# Altium schematic sheet Vapeix_mini_power.SchDoc: Vapeix Mini PCB - Power Supply
size A3; Organization: Altium Limited; Address1: L3, 12a Rodborough Rd; Address2: Frenchs Forest; Address3: NSW; Address4: Australia 2086; Revision: v2.0
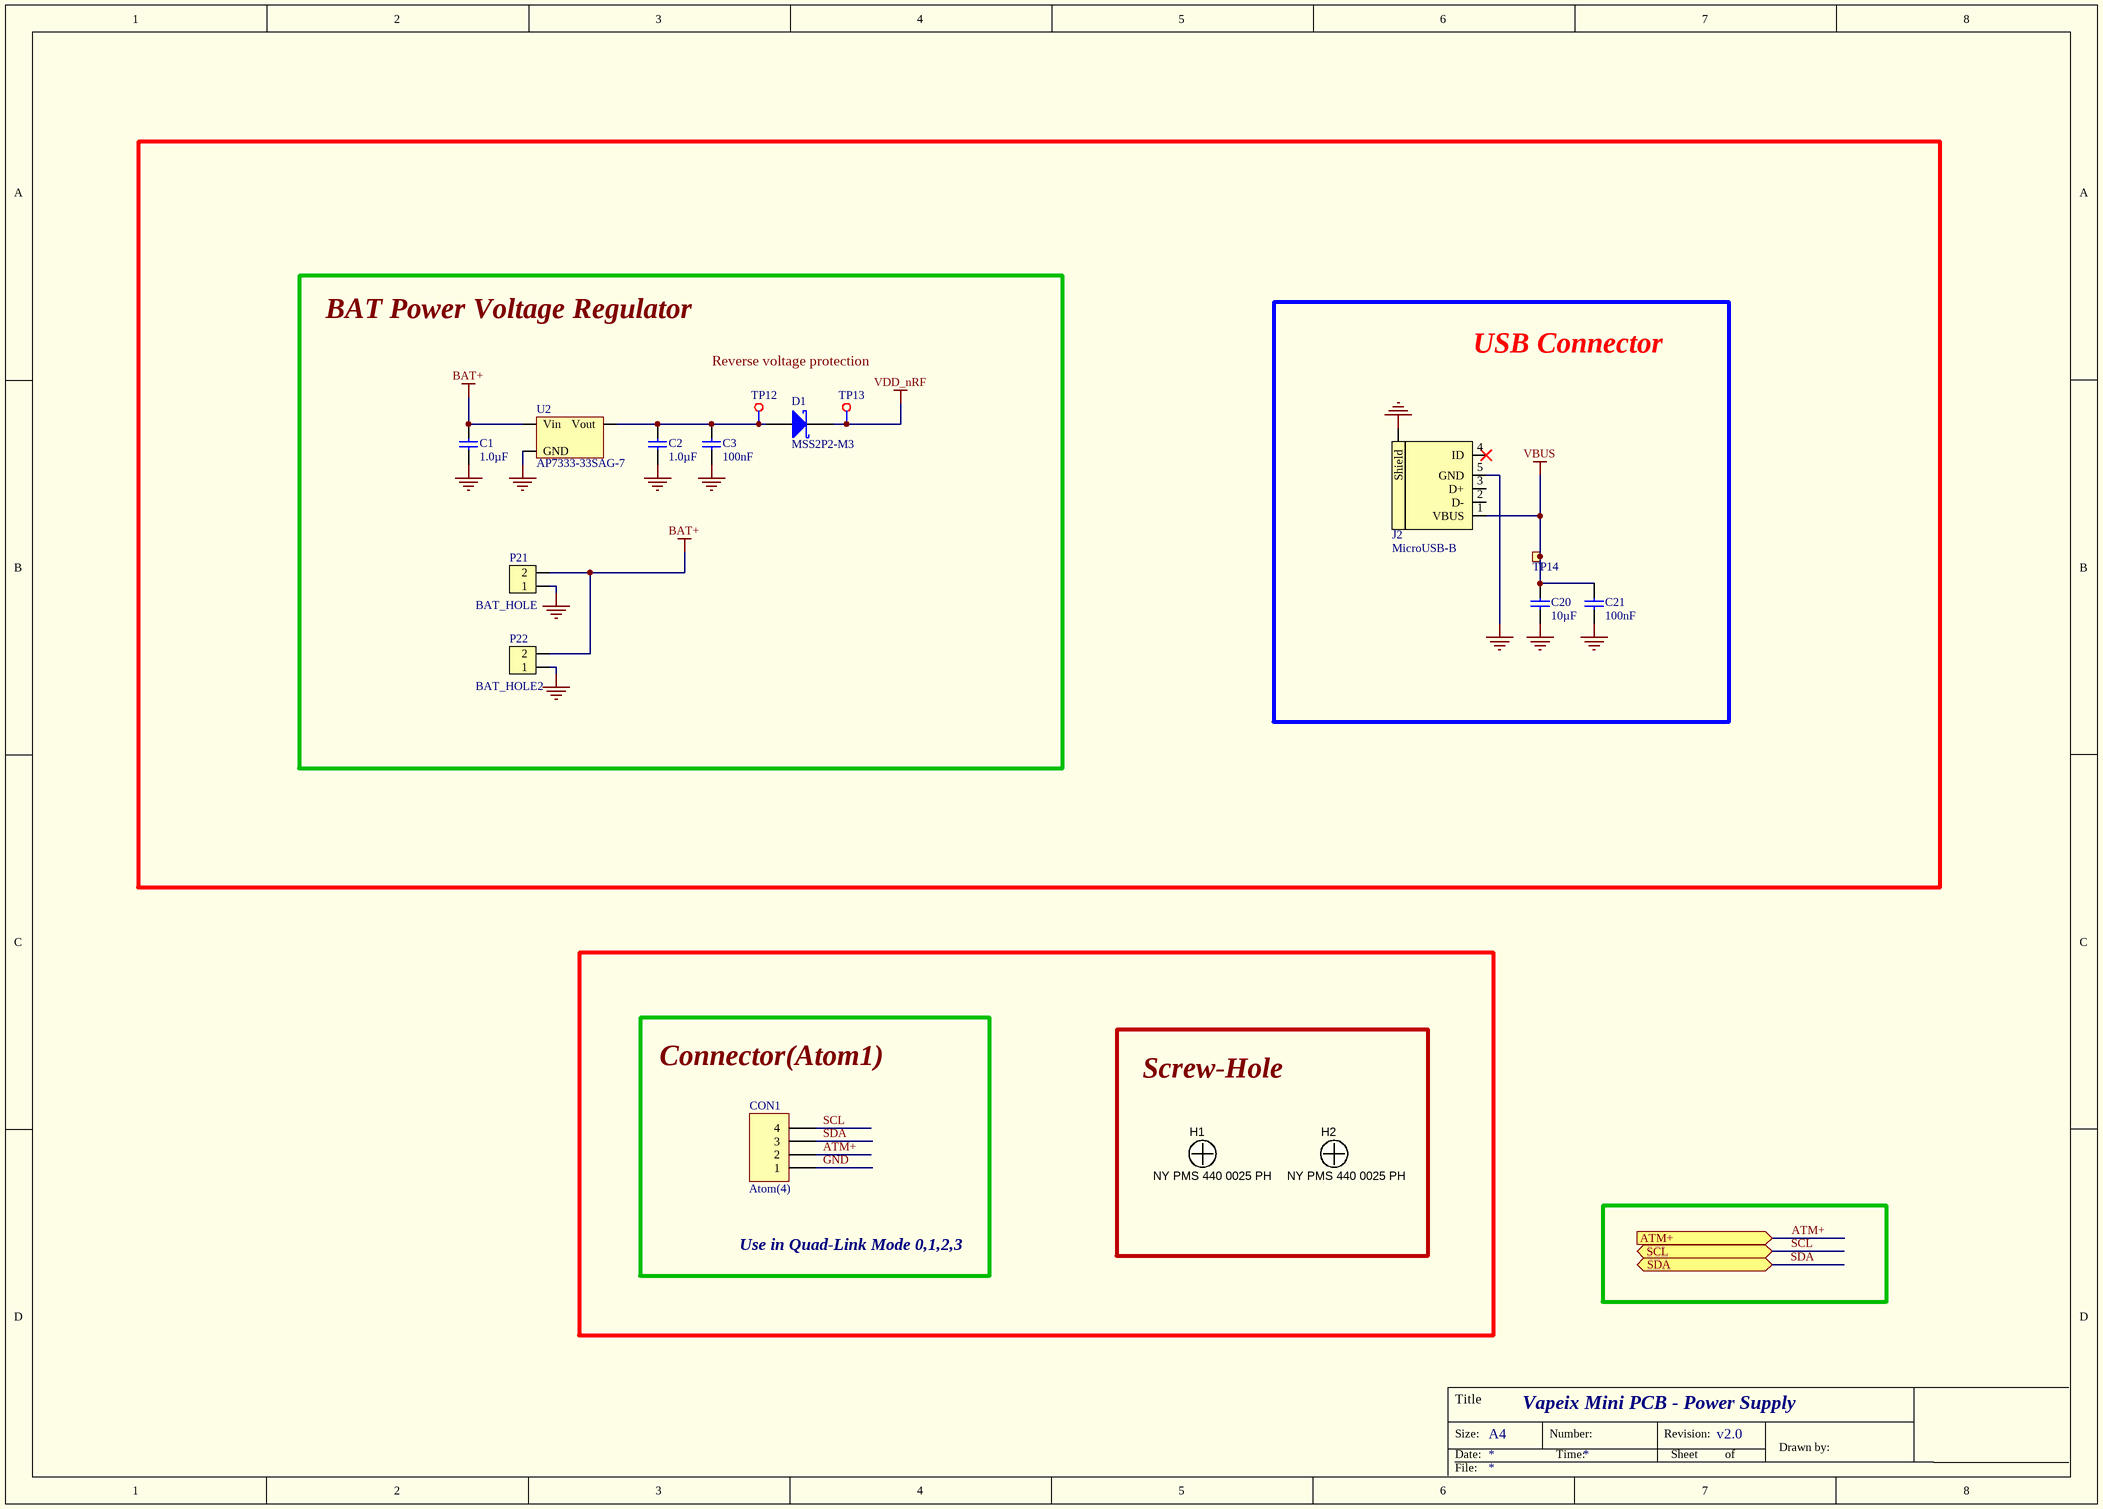
[diagram p0: Vapeix_mini_power.SchDoc]

## Parts
C1  1.0µF  [C0201]
C2  1.0µF  [C0201]
C3  100nF  [C0201]
C20  10µF  [R0402]
C21  100nF  [C0201]
CON1  Atom(4)  [S4B-PH-K-S]
D1  MSS2P2-M3  [MSS2P2-M3]
H1  NY PMS 440 0025 PH  [SCREW_HOLE2]
H2  NY PMS 440 0025 PH  [SCREW_HOLE2]
J2  MicroUSB-B  [FCI_10118193-0001LF]
P21  BAT_HOLE  [CON2]
P22  BAT_HOLE2  [CON2]
TP12  TP  [TP]  (value not drawn)
TP13  TP  [TP]  (value not drawn)
TP14  Ø1.0mm,SMD  [TP_SMD_1.0mm]  (value not drawn)  (no BOM)
U2  AP7333-33SAG-7  [SOT-23A]

## Blocks framed on the sheet
Reverse voltage protection: C1-C3 D1 P21 P22 TP12 TP13 U2

## Ports
ATM+ (in), SCL (bidir), SDA (bidir)

## Nets
BAT+: C1.2 P21.2 P22.2 U2.1(Vin)
GND: C1.1 C2.1 C3.2 C20.1 C21.2 CON1.1 J2.5(GND) J2.6(Shield) P21.1 P22.1 U2.3(GND)
VBUS: C20.2 C21.1 J2.1(VBUS) TP14.1
VDD_nRF: D1.2(K) TP13.1(TP)
ATM+: CON1.2 ; port ATM+
SCL: CON1.4 ; port SCL
SDA: CON1.3 ; port SDA
NetC2_2: C2.2 C3.1 D1.1(A) TP12.1(TP) U2.2(Vout)

Not connected (* = marked no-connect by the designer): J2 2(D-) 3(D+) 4(ID)*

## Notes on the sheet
- Labels drawn without touching a wire or pin: BAT Power Voltage Regulator, Connector(Atom1), Screw-Hole, USB Connector, Use in Quad-Link Mode 0,1,2,3
- Title
- Size:
- Date:
- A4
- Number:
- Time:
- Revision:
- Sheet
- of
- Drawn by:
- File:

## Library data of the parts
C1 C2 = C0603-1µ0: CAP CER 1UF 16V X5R 0201; Manufacturer: Samsung Electro-Mechanics America, Inc.; Manufacturer Part Number: CL03A105MO3NRNH; Pin Count: 2; Value: 1.0µF; Supplier: Digi-Key; Supplier part number: 1276-6798-1-ND; 2nd source Supplier: *; 2nd source part number: *
C3 C21 = C0402-100n: CAP CER 0.1UF 10V X5R 0201; Manufacturer: Murata Electronics North America; Manufacturer Part Number: GRM033R61A104KE15D; Note: 16V; Artikkelnr Noca: 20039200; Artikkelnr Simpro: N.A.; Part Number: C0402-100n; Datasheet: *; LatestRevisionDate: 2009-11-23; Pin Count: 2; Publisher: Nordic Semiconductor; Published: 2009-05-08; Value: 100nF; Supplier: Digi-Key; Supplier part number: 490-5881-1-ND; 2nd source Supplier: *; 2nd source part number: *; Footprint Doc: 0201
C20 = C0603-10µ: CAP CER 10UF 10V X5R 0402; Manufacturer: Samsung Electro-Mechanics America, Inc.; Manufacturer Part Number: CL05A106MP5NUNC; Note: 6.3V; Artikkelnr Noca: 20039234; Artikkelnr Simpro: N.A.; Datasheet: *; LatestRevisionDate: 2011-01-17; Pin Count: 2; Publisher: Nordic Semiconductor; Published: 2011-01-17; Value: 10µF; Supplier: Digi-Key; Supplier part number: 1276-1450-2-ND; 2nd source Supplier: *; 2nd source part number: *; Footprint Doc: 0402
CON1 = S4B-PH-K-S(LF)(SN): CONN HEADER PH SIDE 4POS 2MM; Manufacturer: JST Sales America Inc.; Connector Type: Header, Shrouded; Number of Positions: 4; Number of Positions Loaded: All; Pitch: 0.079" (2.00mm); Supplier 1: Digi-Key; Manufacturer Part Number: S4B-PH-K-S(LF)(SN); RoHS: RoHS Compliant; Category: Connectors, Interconnects; Stock 1: 41576; Pricing 1: 1=0.22, 10=0.208, 25=0.1772, 50=0.155, 100=0.144, 250=0.1274, 500=0.12186, 1000=0.0997, 2500=0.09139 (USD); Packaging: Bulk; Contact Type: Male Pin; Number of Rows: 1; Row Spacing: -; Contact Mating Length: 0.130" (3.30mm); Mounting Type: Through Hole, Right Angle; Termination: Press-Fit, Solder; Fastening Type: Detent Lock; Features: -; Contact Finish: Tin; Contact Finish Thickness: -; Color: Natural; ComponentLink1URL: http://www.jst-mfg.com/product/pdf/eng/ePH.pdf; ComponentLink1Description: http://www.jst-mfg.com/product/pdf/eng/ePH.pdf
D1 = MSS2P2-M3/89A: DIODE SCHOTTKY 20V 2A MICROSMP; Manufacturer: Vishay Semiconductor Diodes Division; Voltage - Forward (Vf) (Max) @ If: 600mV @ 2A; Speed: Fast Recovery =< 500ns, > 200mA (Io); Current - Reverse Leakage @ Vr: 250µA @ 20V; Capacitance @ Vr, F: 65pF @ 4V, 1MHz; Supplier 1: Digi-Key; Manufacturer Part Number: MSS2P2-M3/89A; RoHS: RoHS Compliant; Category: Discrete Semiconductor Products; Stock 1: 3961; Pricing 1: 1=0.37, 10=0.274, 100=0.1552, 500=0.1029, 1000=0.07892 (USD); Packaging: Digi-Reel®; Diode Type: Schottky; Voltage - DC Reverse (Vr) (Max): 20V; Current - Average Rectified (Io): 2A; Reverse Recovery Time (trr): -; Mounting Type: Surface Mount; Package / Case: MicroSMP; Supplier Device Package: MicroSMP; Operating Temperature - Junction: -55°C ~ 150°C; ComponentLink1URL: http://www.vishay.com/docs/89054/mss2p3.pdf; ComponentLink1Description: http://www.vishay.com/docs/89054/mss2p3.pdf
H1 H2 = Screw-Hole: Machine Screw, Round, #4-40 x 1/4, Nylon, Philips panhead; Manufacturer: B&F Fastener Supply; Manufacturer Part Number: CP2102-GM; CompType: Hardware; SymbolCreator: codlsc; U/M: EA; USB Type: USB UART; USB Standard: USB 2.0; Supply Voltage Min: 3; Supply Voltage Max: 3.6; Interface Case Style: QFN; No. of Pins: 28; Data Rate: 1; No. of Ports: 1 Port; Base Number: 2102; Bridge Type: USB to UART; Supply Voltage Range: 3V to 5.25V<!--FANDB--><div class="features-and-benefits-container"><div class="features-and-benefits-desc-container"><span class="features-and-benefits-container-desc">USB to UART Bridge Controller in QFN-28 Package</span></div><div class="features-and-benefits-description"><span class="features-benefits-value">The CP2102-GM is a highly integrated USB to UART Bridge Controller providing a simple solution for updating RS-232 designs to USB using a minimum of components and PCB space. The CP2102-GM includes a USB 2.0 full speed function controller, USB transceiver, oscillator, EEPROM, and asynchronous serial data bus (UART) with full modem control signals. No other external USB components are required. The on chip EEPROM may be used to customise the USB Vendor ID, Product ID, Product Description String, Power Descriptor, Device Release Number, and Device Serial Number as desired for OEM applications. The EEPROM is programmed on board via the USB, allowing the programming step to be easily integrated into the product manufacturing and testing process.</span></div><div class="features-and-benefits-list"><ul class="features-and-benefits-list-list"><li class="features-and-benefits-list-item">Integrated USB transceiver; no external crystal required</li><li class="features-and-benefits-list-item">Integrated 1024 Byte EEPROM</li><li class="features-and-benefits-list-item">On chip power on reset circuit</li><li class="features-and-benefits-list-item">On chip voltage regulator: 3.3V output</li><li class="features-and-benefits-list-item">USB Specification 2.0 compliant; full-speed (12 Mbps)</li><li class="features-and-benefits-list-item">USB suspend states supported via SUSPEND pins</li><li class="features-and-benefits-list-item">All handshaking and modem interface signals</li><li class="features-and-benefits-list-item">Baud rates: 300 bps to 1 Mbits</li><li class="features-and-benefits-list-item">576 Byte receive buffer; SymbolVersion: 2009-10-28; MountType: N/A; RoHS: Y; PartNumber: NY PMS 440 0025 PH; PackageReference: Screw; DigiKeyPartNumber: H542-ND; ComponentLink1Description: Datasheet Link; ComponentLink1URL: http://www.fasnetdirect.com/refguide/Machinepancombo.pdf; ClassName: Mounting Holes; LatestRevisionDate: 2014-05-15; Publisher: Texas Instruments; Supplier 1: Digi-Key; Supplier Part Number 1: H542-ND; Supplier 4: Farnell; Stock 4: 9194; Pricing 4: 1=1.82, 10=1.72, 100=1.69, 250=1.66, 500=1.62, 2000=1.59, 3000=1.56, 5000=1.55 (GBP); Operating Temperature Min: -40; Operating Temperature Max: 85; Packaging: Each; MSL: -; Logic Function Number: 2102; Operating Temperature Range: -40°C to +85; ComponentLink2URL: http://www.farnell.com/datasheets/1694195.pdf; ComponentLink2Description: http://www.farnell.com/datasheets/1694195.pdf; Supplier Part Number 4: 9282130
J2 = FCI 10118193-0001LF: MicroUSB-B-SMT; Manufacturer: FCI; 2nd source part number: 649-10118193-0001LF; Artikkelnr Noca: N.A.; Part Number: FCI 10118193-0001LF; Manufacturer Part Number: 10118193-0001LF; Datasheet: http://portal.fciconnect.com/Comergent//fci/drawing/10118193.pdf; Footprint Doc: FCI_10118193-0001LF; LatestRevisionDate: 2014-10-07; Pin Count: 5; Publisher: Nordic Semiconductor; Published: 2014-10-07; Value: MicroUSB-B; Note: *; Supplier: Digi-Key; Supplier part number: 609-4616-1-ND; 2nd source Supplier: Mouser; Artikkelnr Simpro: N.A.
P21 P22 = Pin List Ang 1x2 SMD, 2.54mm: Pin List 1x2, 2.54mm (100mil), Right Angled, SMD; 2nd source part number: S1113E-02-ND; Artikkelnr Noca: N.A.; Part Number: Pin List Ang 1x2 SMD, 2.54mm; Manufacturer: *; Manufacturer Part Number: *; Datasheet: *; LatestRevisionDate: 2014-04-30; Pin Count: 2; Publisher: Nordic Semiconductor; Published: 2014-04-30; Note: *; Supplier: Samtec; Supplier part number: TSM-102-01-L-SH-A; 2nd source Supplier: Digi-Key; Footprint Doc: LIST_ANG_1x2-SMD-2.54MM; Artikkelnr Simpro: N.A.
  P21: Value: BAT_HOLE
  P22: Value: BAT_HOLE2
TP12 TP13 = TP: TEST POINT
TP14 = TESTPAD: 1.0mm circular SMD testpad; Part Number: TP_SMD_Ø1.0MM; Manufacturer: Nordic Semiconductor; Artikkelnr Noca: N.A.; Manufacturer Part Number: *; Datasheet: *; LatestRevisionDate: 2013-06-11; Pin Count: 1; Publisher: Nordic Semiconductor; Published: 2013-06-11; Value: Ø1.0mm,SMD; Note: *; Supplier: *; Supplier part number: *; 2nd source Supplier: *; 2nd source part number: *; Footprint Doc: TP_SMD_Ø1.0mm; Artikkelnr Simpro: N.A.
U2 = AP7333-33SAG-7: 300mA, Low Quiescent Current, Fast Transient Low Dropout Linear Regulator; Manufacturer: Diodes Incorporated; Artikkelnr Noca: 17039216; Artikkelnr Simpro: N.A.; Part Number: AP7333-33SAG-7; Manufacturer Part Number: AP7333-33SAG-7; Datasheet: http://www.diodes.com/datasheets/AP7333.pdf; LatestRevisionDate: 2012-06-15; Pin Count: 3; Publisher: Nordic Semiconductor; Published: 2012-06-15; Value: AP7333-33SAG-7; Note: *; Supplier: Digi-Key; Supplier part number: AP7333-33SAG-7DICT-ND; 2nd source Supplier: *; 2nd source part number: *; Footprint Doc: SOT-23-3